# Altium schematic sheet [1] - COVER PAGE.SchDoc: COVER SHEET
size B; DocumentNumber: 1; Revision: V1I1; SheetNumber: 1; SheetTotal: 16
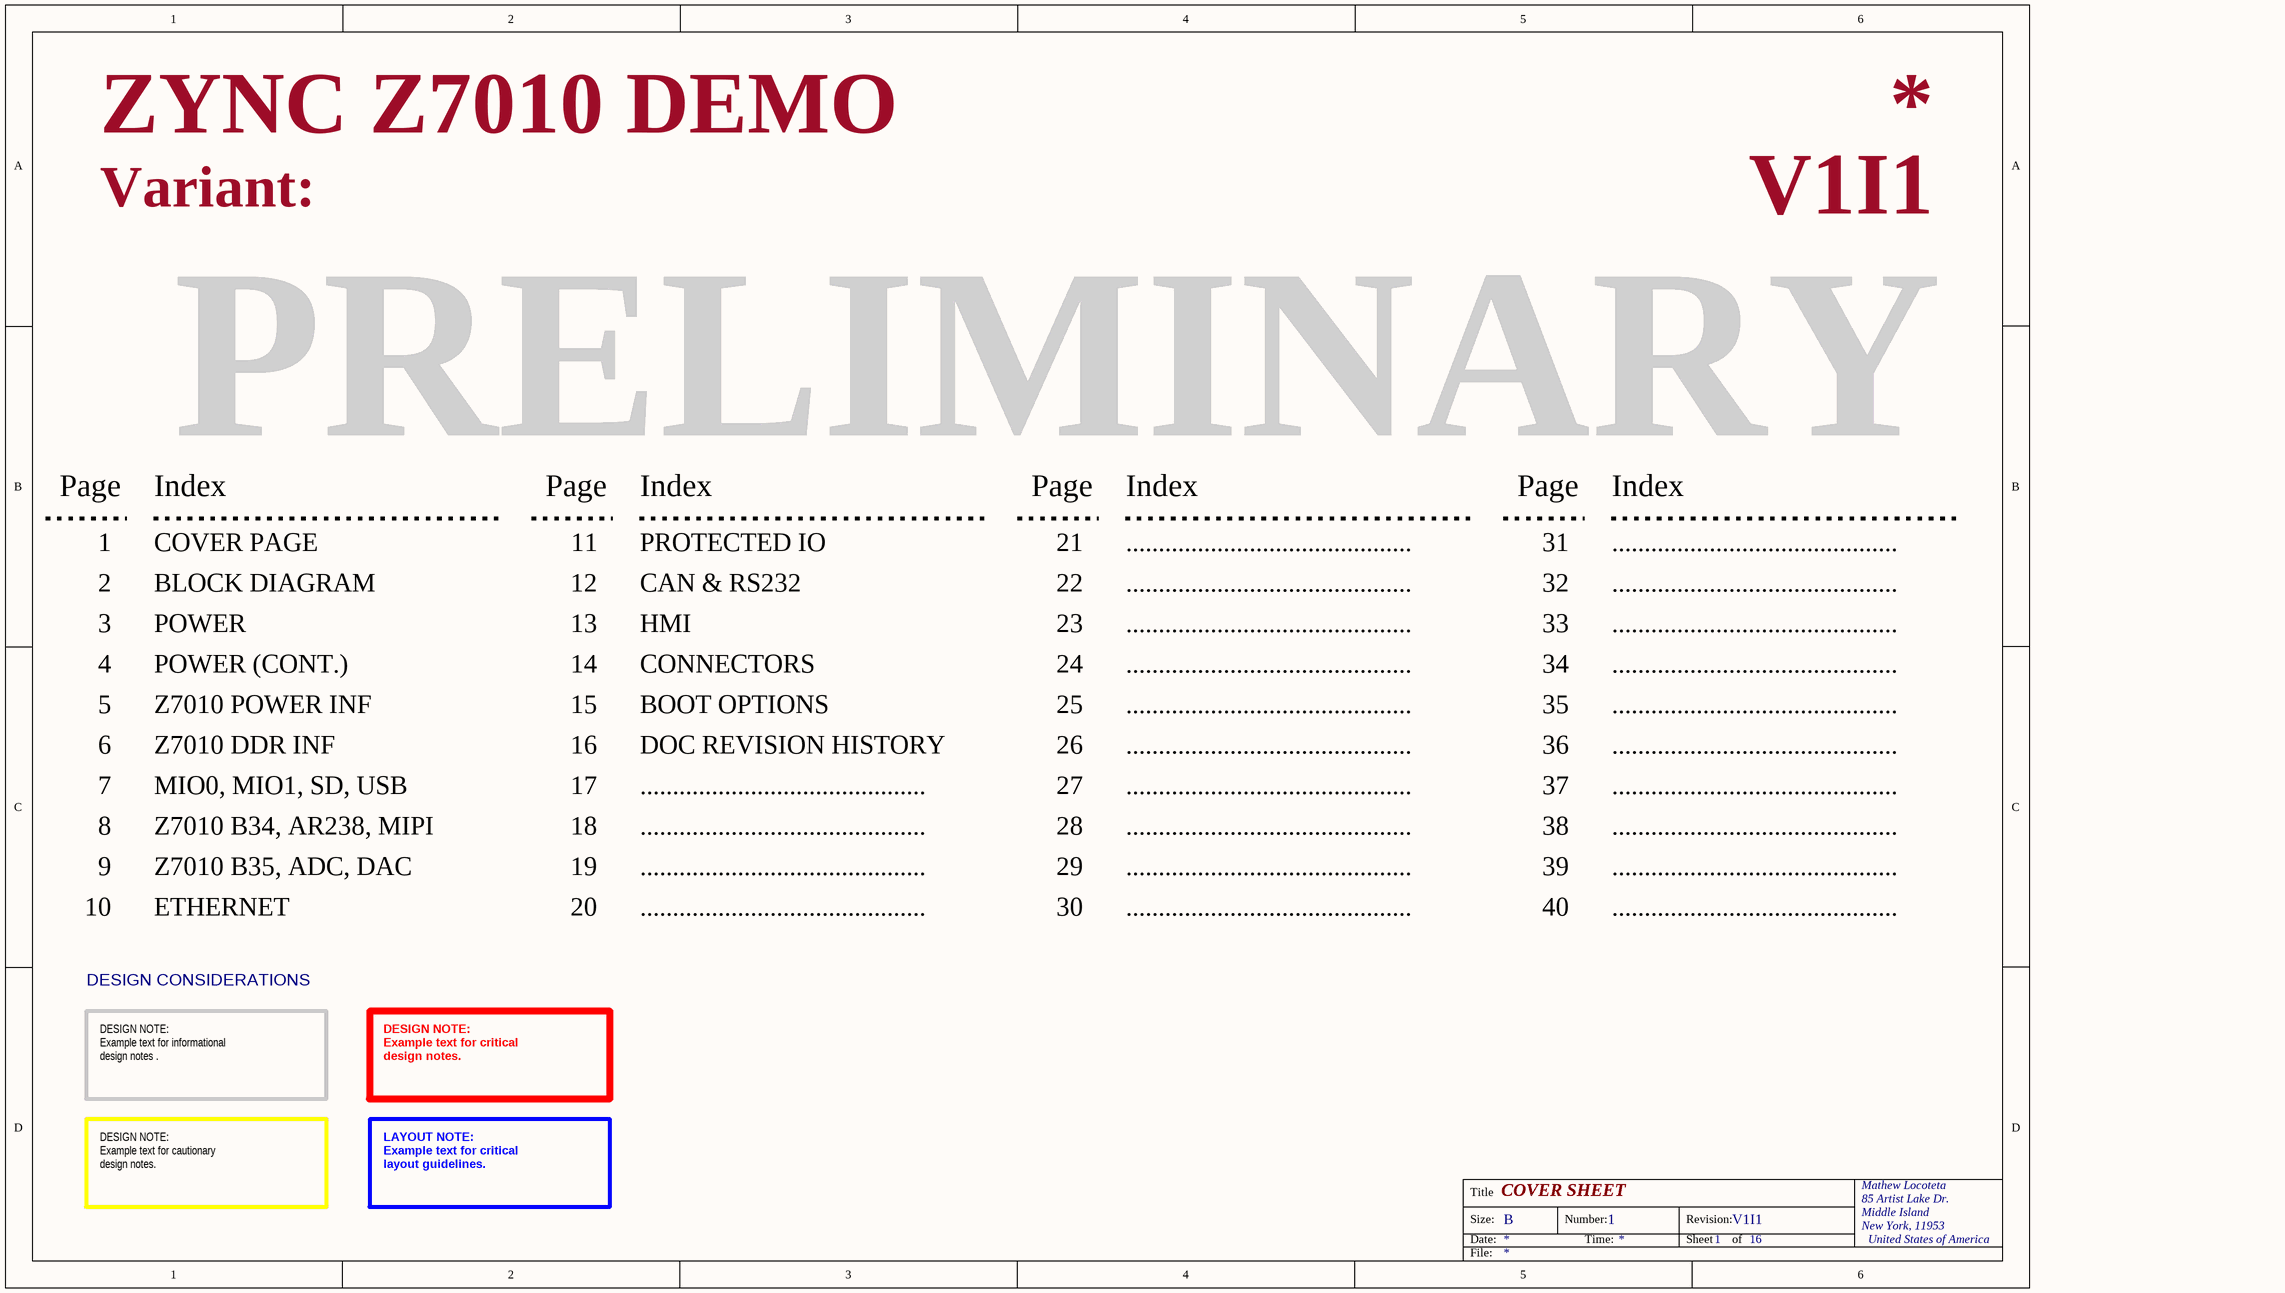
[diagram p0: [1] - COVER PAGE.SchDoc]

## Notes on the sheet
- ZYNC Z7010 DEMO
- Variant:
- V1I1
- Page
- Index
- PRELIMINARY
- 1
- COVER PAGE
- 11
- PROTECTED IO
- 21
- ............................................
- 31
- 2
- 3
- BLOCK DIAGRAM
- POWER
- 12
- 13
- CAN & RS232
- HMI
- 22
- 23
- 32
- 33
- 4
- POWER (CONT.)
- 14
- CONNECTORS
- 24
- 34
- 5
- 6
- Z7010 POWER INF
- Z7010 DDR INF
- 15
- 16
- BOOT OPTIONS
- DOC REVISION HISTORY
- 25
- 26
- 35
- 36
- 7
- 8
- MIO0, MIO1, SD, USB
- Z7010 B34, AR238, MIPI
- 17
- 18
- 27
- 28
- 37
- 38
- 9
- Z7010 B35, ADC, DAC
- 19
- 29
- 39
- 10
- ETHERNET
- 20
- 30
- 40
- DESIGN CONSIDERATIONS
- DESIGN NOTE:
  Example text for informational
  design notes .
- DESIGN NOTE:
  Example text for critical
  design notes.
- DESIGN NOTE:
  Example text for cautionary
  design notes.
- LAYOUT NOTE:
  Example text for critical
  layout guidelines.
- Title
- Size:
- Date:
- B
- Number:
- Time:
- Revision:
- Sheet
- of
- Mathew Locoteta
- 85 Artist Lake Dr.
- Middle Island
- New York, 11953
- United States of America
- File: